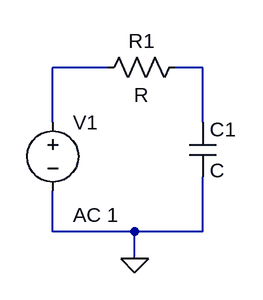
[diagram p0: schematic Draft1.asc]
Draft1.asc, the LTspice schematic file:
Version 4
SHEET 1 880 680
WIRE 96 64 32 64
WIRE 208 64 176 64
WIRE 32 128 32 64
WIRE 208 128 208 64
WIRE 32 256 32 208
WIRE 128 256 32 256
WIRE 208 256 208 192
WIRE 208 256 128 256
WIRE 128 288 128 256
FLAG 128 288 0
SYMBOL voltage 32 112 R0
WINDOW 123 24 124 Left 2
WINDOW 39 0 0 Left 0
SYMATTR InstName V1
SYMATTR Value ""
SYMATTR Value2 AC 1
SYMBOL cap 192 128 R0
SYMATTR InstName C1
SYMBOL res 192 48 R90
WINDOW 0 0 56 VBottom 2
WINDOW 3 32 56 VTop 2
SYMATTR InstName R1

The netlist it stands for:
* Draft1.asc
V1 N001 0 AC 1
C1 N002 0 C
R1 N002 N001 R
.backanno
.end